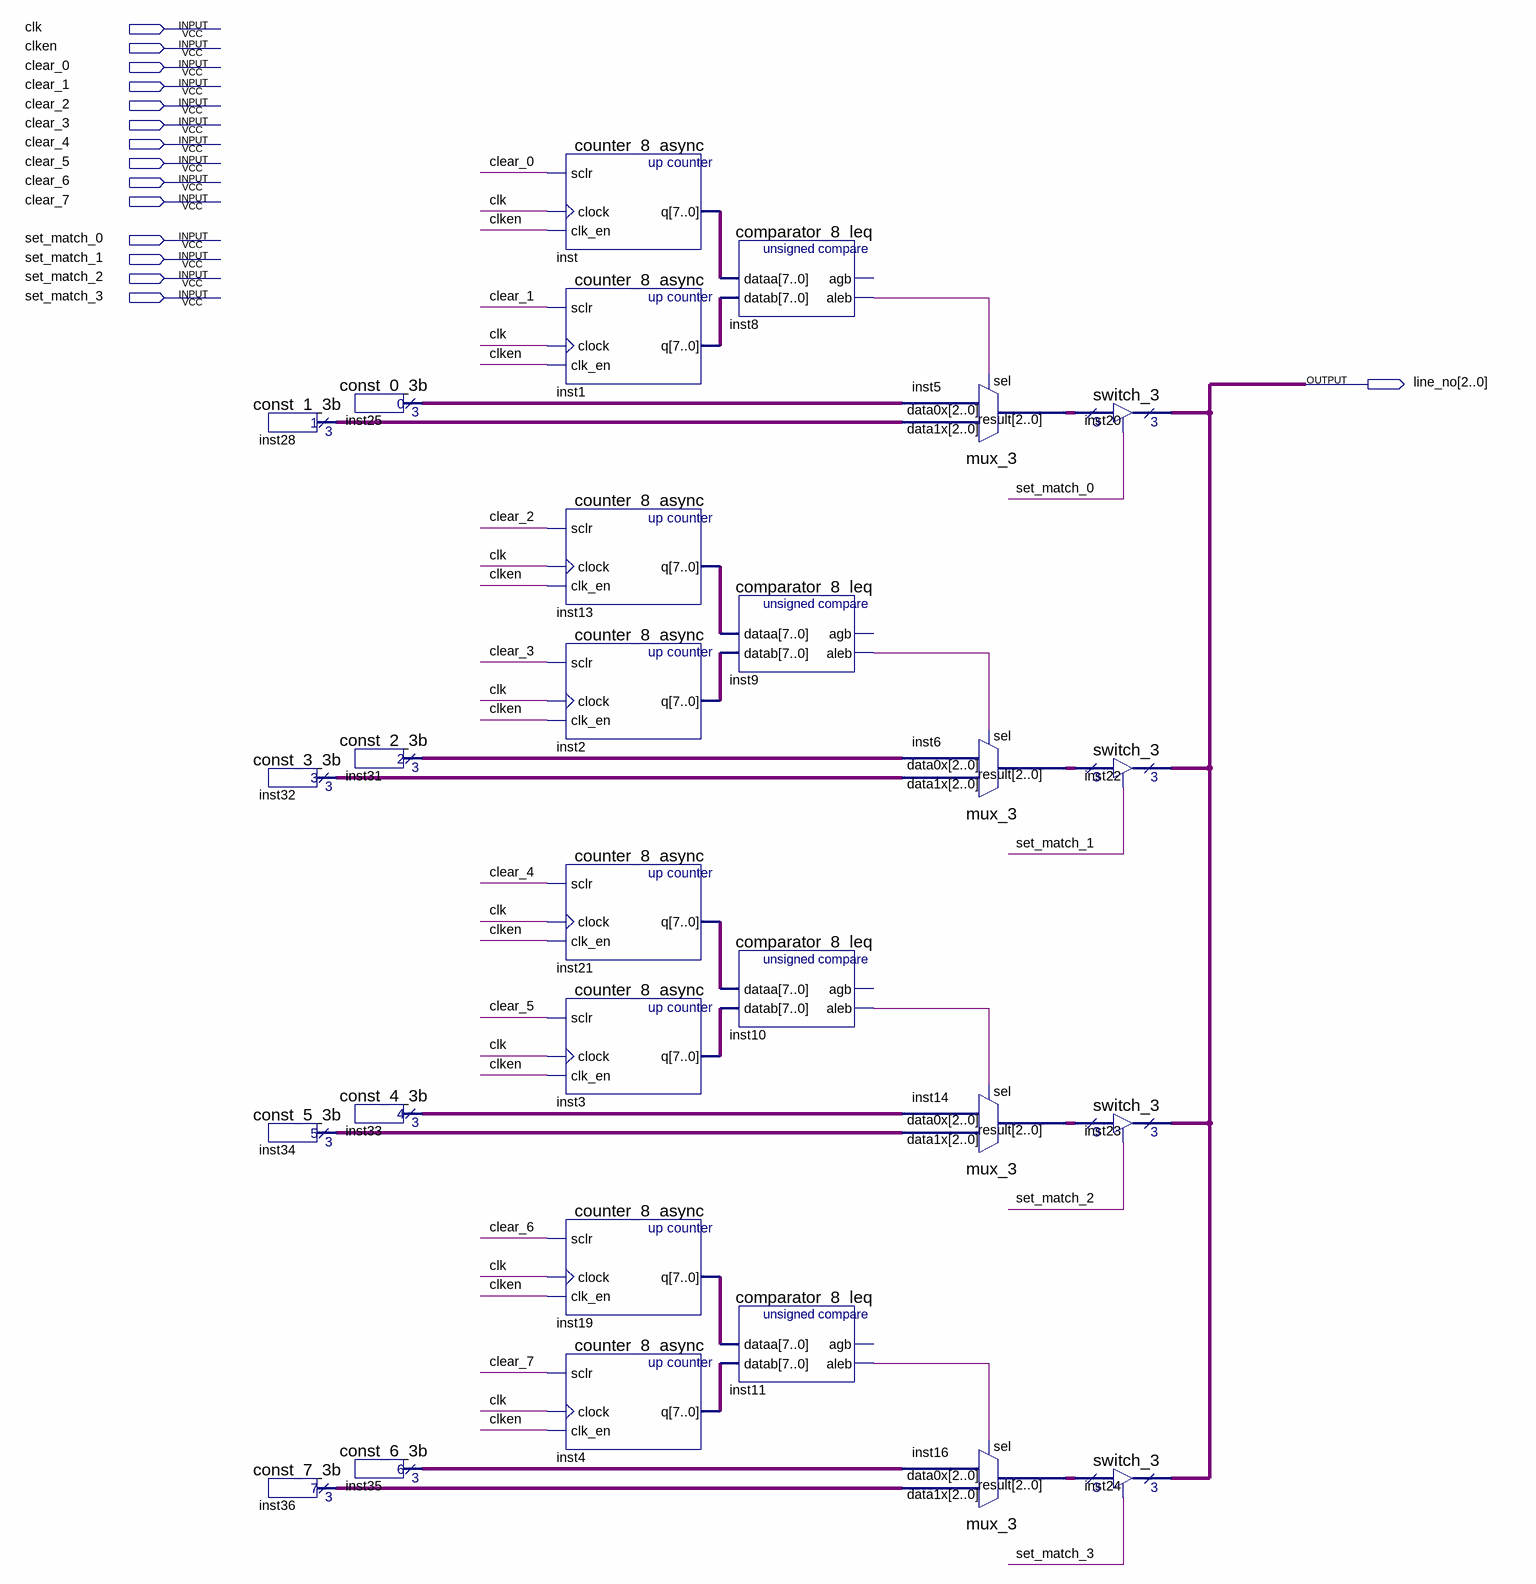
[diagram p0: schematic sheet]
// Quartus schematic cache_count.bdf as structural Verilog: 28 symbols, 15 pins
module cache_count (
  input  clk,
  input  clken,
  input  clear_0,
  input  clear_1,
  input  clear_2,
  input  clear_3,
  input  clear_4,
  input  clear_5,
  input  clear_6,
  input  clear_7,
  input  set_match_0,
  input  set_match_1,
  input  set_match_2,
  input  set_match_3,
  output [2:0] line_no
);

  wire inst8_aleb, inst9_aleb, inst10_aleb, inst11_aleb;
  wire [2:0] inst5_result, inst6_result, inst14_result, inst16_result, inst25_result, inst28_result,
       inst31_result, inst32_result, inst33_result, inst34_result, inst35_result, inst36_result;
  wire [7:0] inst1_q, inst2_q, inst3_q, inst4_q, inst13_q, inst19_q, inst21_q, inst_q;

  const_1_3b inst28 (.result(inst28_result));
  const_3_3b inst32 (.result(inst32_result));
  const_5_3b inst34 (.result(inst34_result));
  const_7_3b inst36 (.result(inst36_result));
  const_0_3b inst25 (.result(inst25_result));
  const_2_3b inst31 (.result(inst31_result));
  const_4_3b inst33 (.result(inst33_result));
  const_6_3b inst35 (.result(inst35_result));
  counter_8_async inst (.sclr(clear_0), .clock(clk), .clk_en(clken), .q(inst_q));
  counter_8_async inst1 (.sclr(clear_1), .clock(clk), .clk_en(clken), .q(inst1_q));
  counter_8_async inst13 (.sclr(clear_2), .clock(clk), .clk_en(clken), .q(inst13_q));
  counter_8_async inst2 (.sclr(clear_3), .clock(clk), .clk_en(clken), .q(inst2_q));
  counter_8_async inst21 (.sclr(clear_4), .clock(clk), .clk_en(clken), .q(inst21_q));
  counter_8_async inst3 (.sclr(clear_5), .clock(clk), .clk_en(clken), .q(inst3_q));
  counter_8_async inst19 (.sclr(clear_6), .clock(clk), .clk_en(clken), .q(inst19_q));
  counter_8_async inst4 (.sclr(clear_7), .clock(clk), .clk_en(clken), .q(inst4_q));
  comparator_8_leq inst8 (.dataa(inst_q), .datab(inst1_q), .aleb(inst8_aleb));  // open: agb
  comparator_8_leq inst9 (.dataa(inst13_q), .datab(inst2_q), .aleb(inst9_aleb));  // open: agb
  comparator_8_leq inst10 (.dataa(inst21_q), .datab(inst3_q), .aleb(inst10_aleb));  // open: agb
  comparator_8_leq inst11 (.dataa(inst19_q), .datab(inst4_q), .aleb(inst11_aleb));  // open: agb
  mux_3 inst5 (.data1x(inst28_result), .data0x(inst25_result), .sel(inst8_aleb), .result(inst5_result));
  mux_3 inst6 (.data1x(inst32_result), .data0x(inst31_result), .sel(inst9_aleb), .result(inst6_result));
  mux_3 inst14 (.data1x(inst34_result), .data0x(inst33_result), .sel(inst10_aleb), .result(inst14_result));
  mux_3 inst16 (.data1x(inst36_result), .data0x(inst35_result), .sel(inst11_aleb), .result(inst16_result));
  switch_3 inst20 (.enabledt(set_match_0), .data(inst5_result), .tridata(line_no));
  switch_3 inst22 (.enabledt(set_match_1), .data(inst6_result), .tridata(line_no));
  switch_3 inst23 (.enabledt(set_match_2), .data(inst14_result), .tridata(line_no));
  switch_3 inst24 (.enabledt(set_match_3), .data(inst16_result), .tridata(line_no));
endmodule
